# EasyEDA Pro project Loongson_Drivers.epro, schematic Schematic1

## Sheets
1 P1: Board Name: Board1; Create Date: 2025-04-17; Page Name: P1; Project Name: 龙芯驱动板; Schematic Name: Schematic1; Update Date: 2025-04-22; Company: 嘉立创EDA; Page Size: A4; Version: V1.0
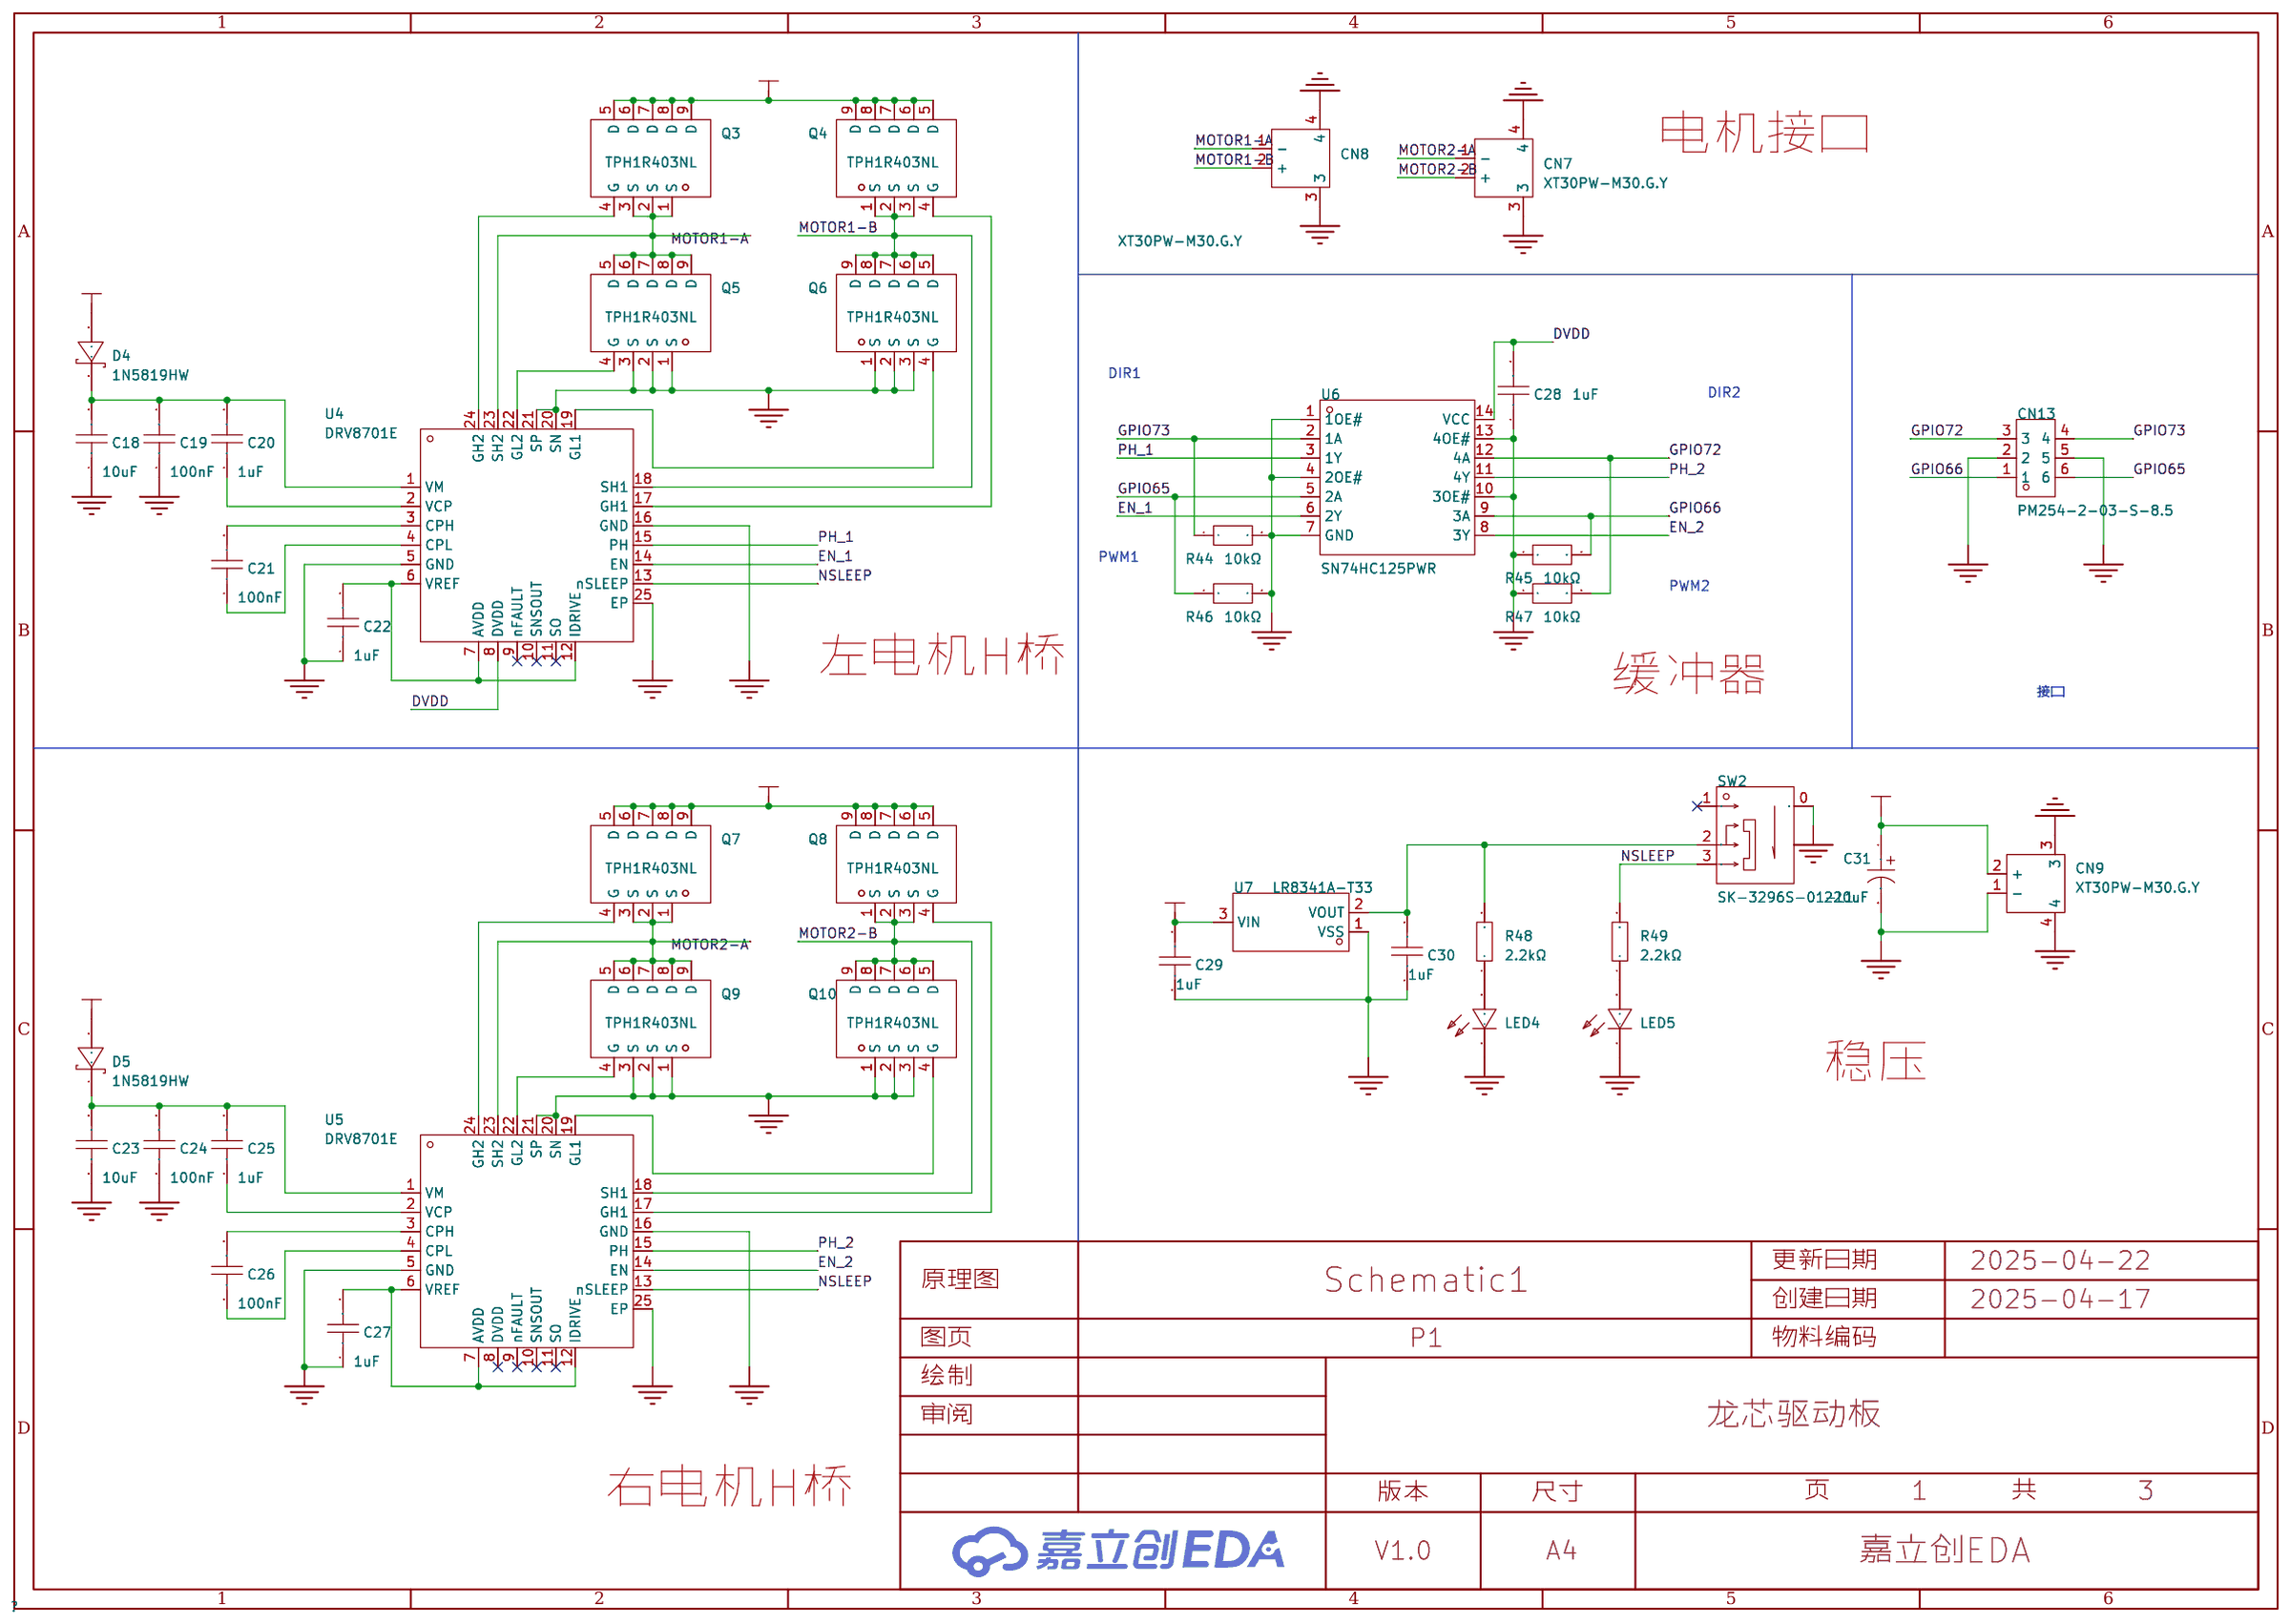
[diagram p0: P1]
2 P2: Create Date: 2025-04-18; Page Name: P2; Update Date: 2025-06-28
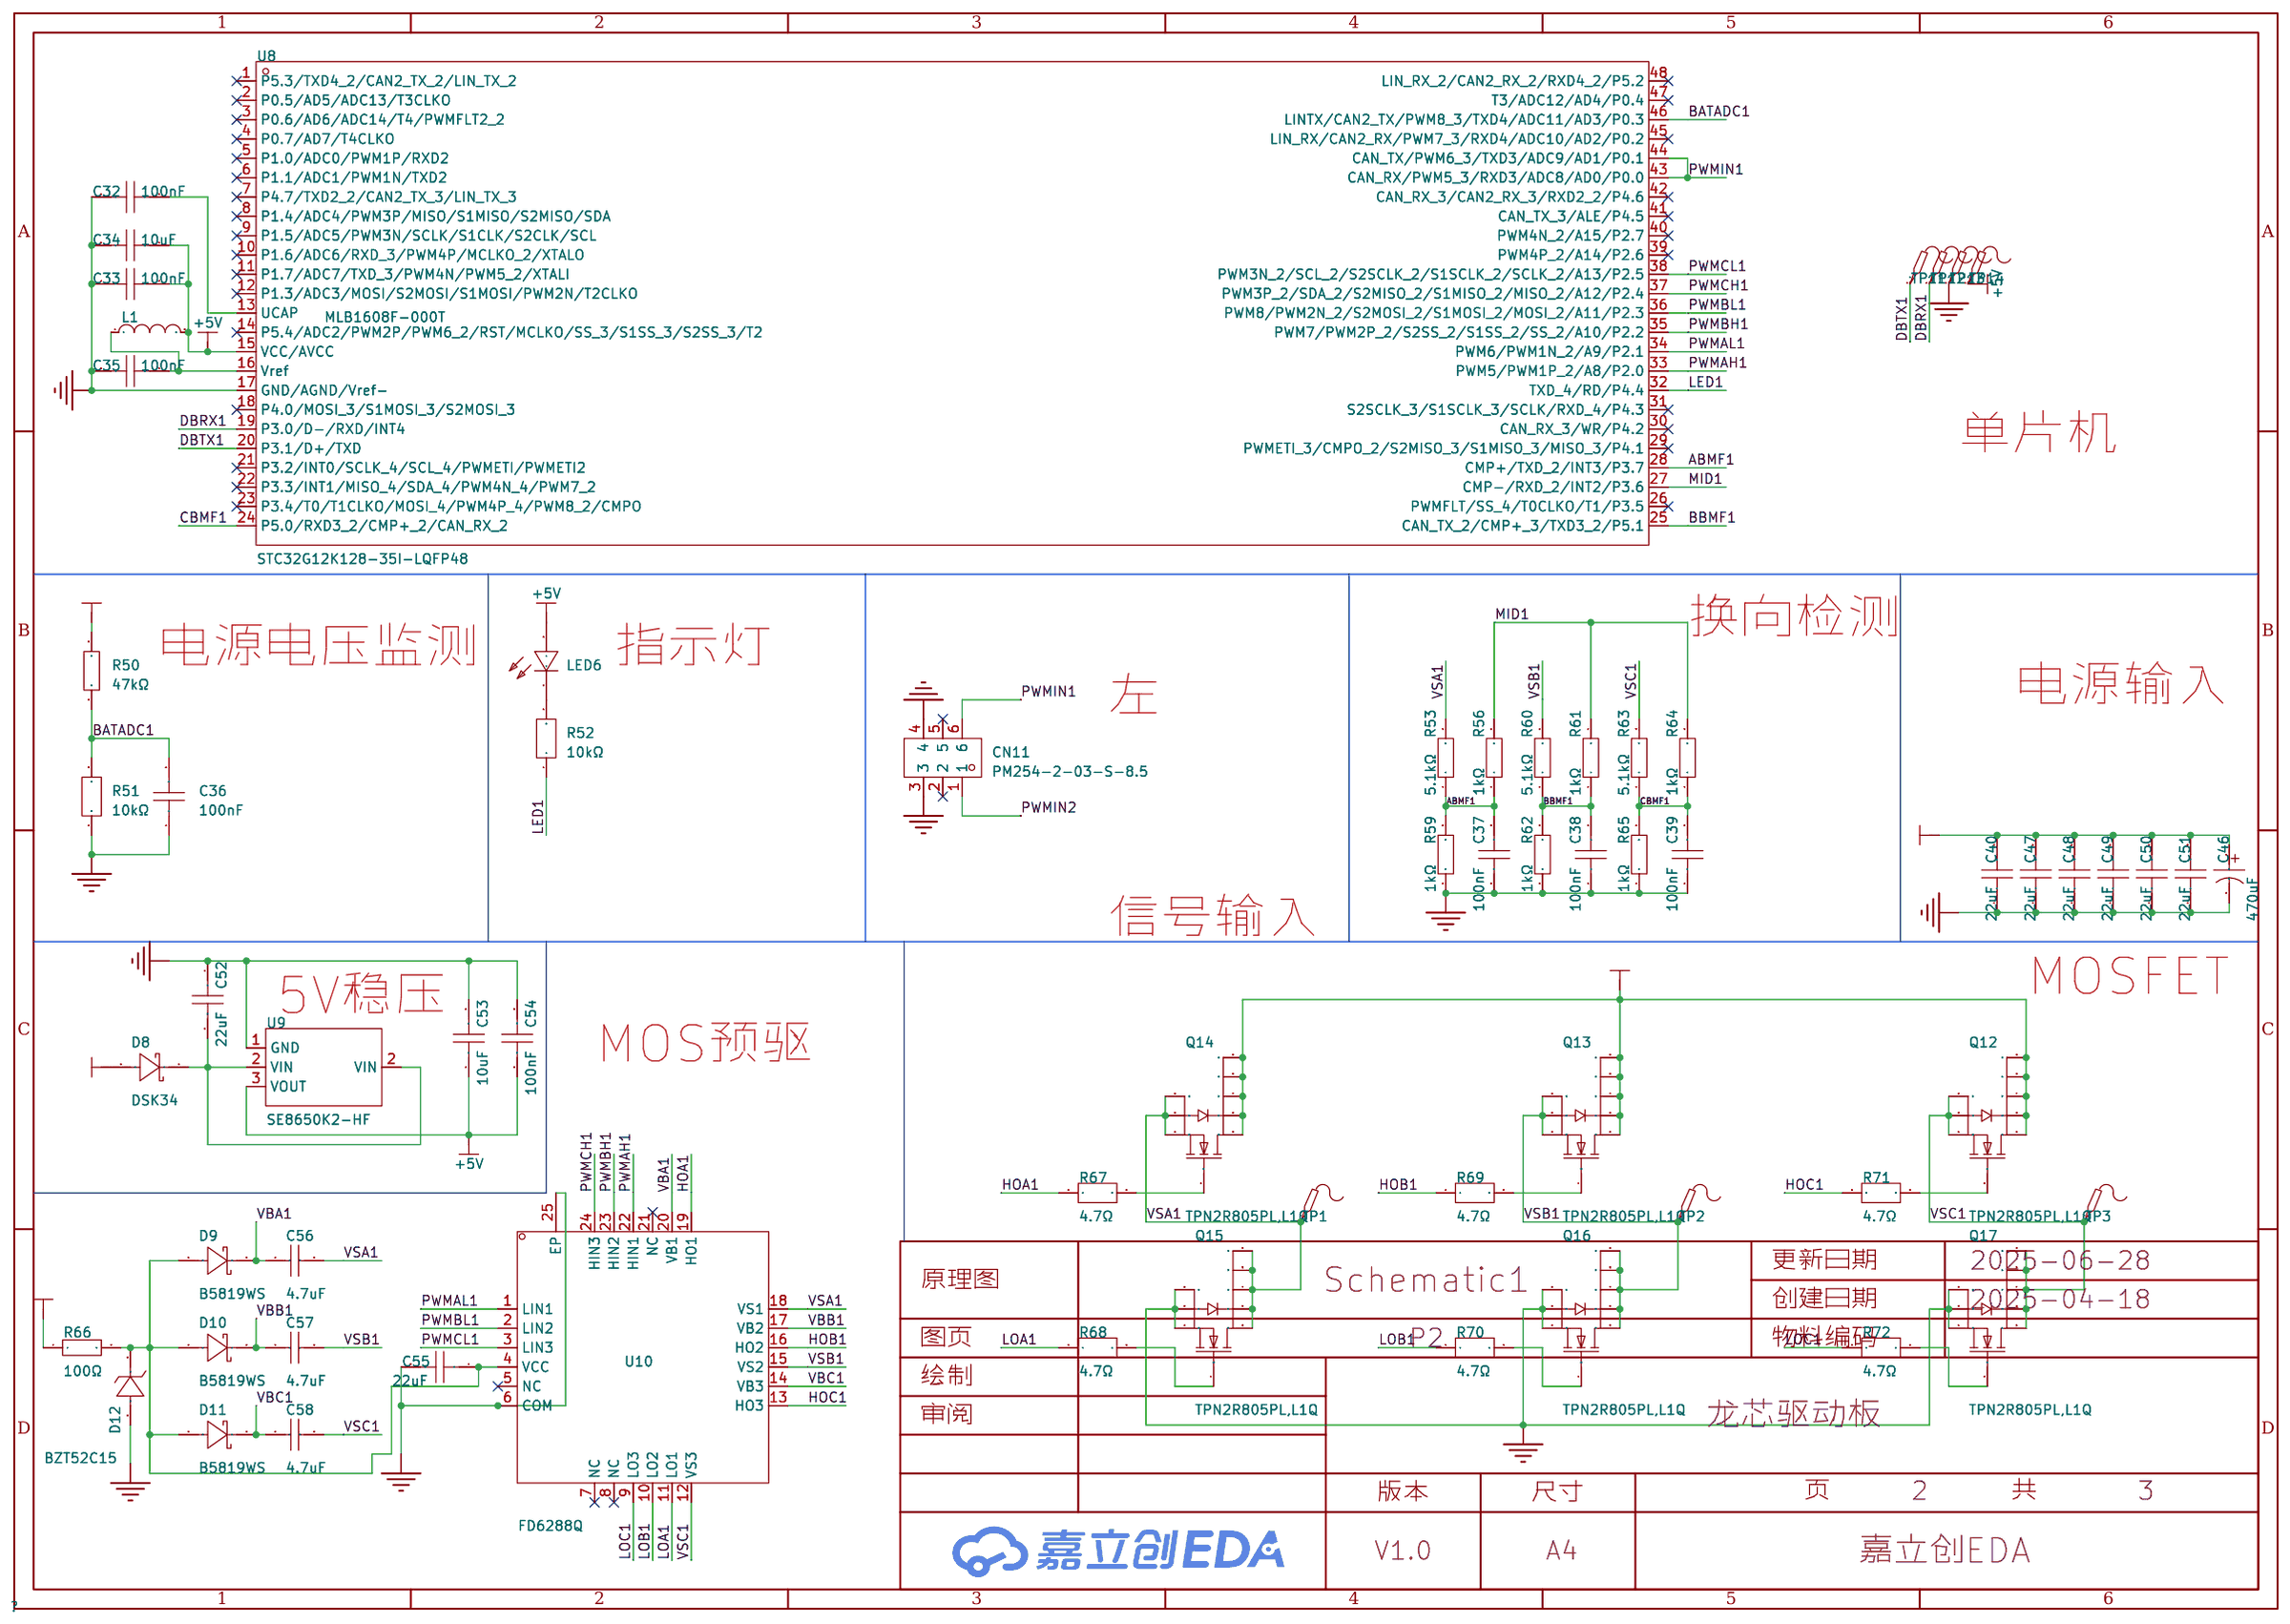
[diagram p1: P2]
3 P3: Create Date: 2025-04-18; Page Name: P3; Update Date: 2025-06-29
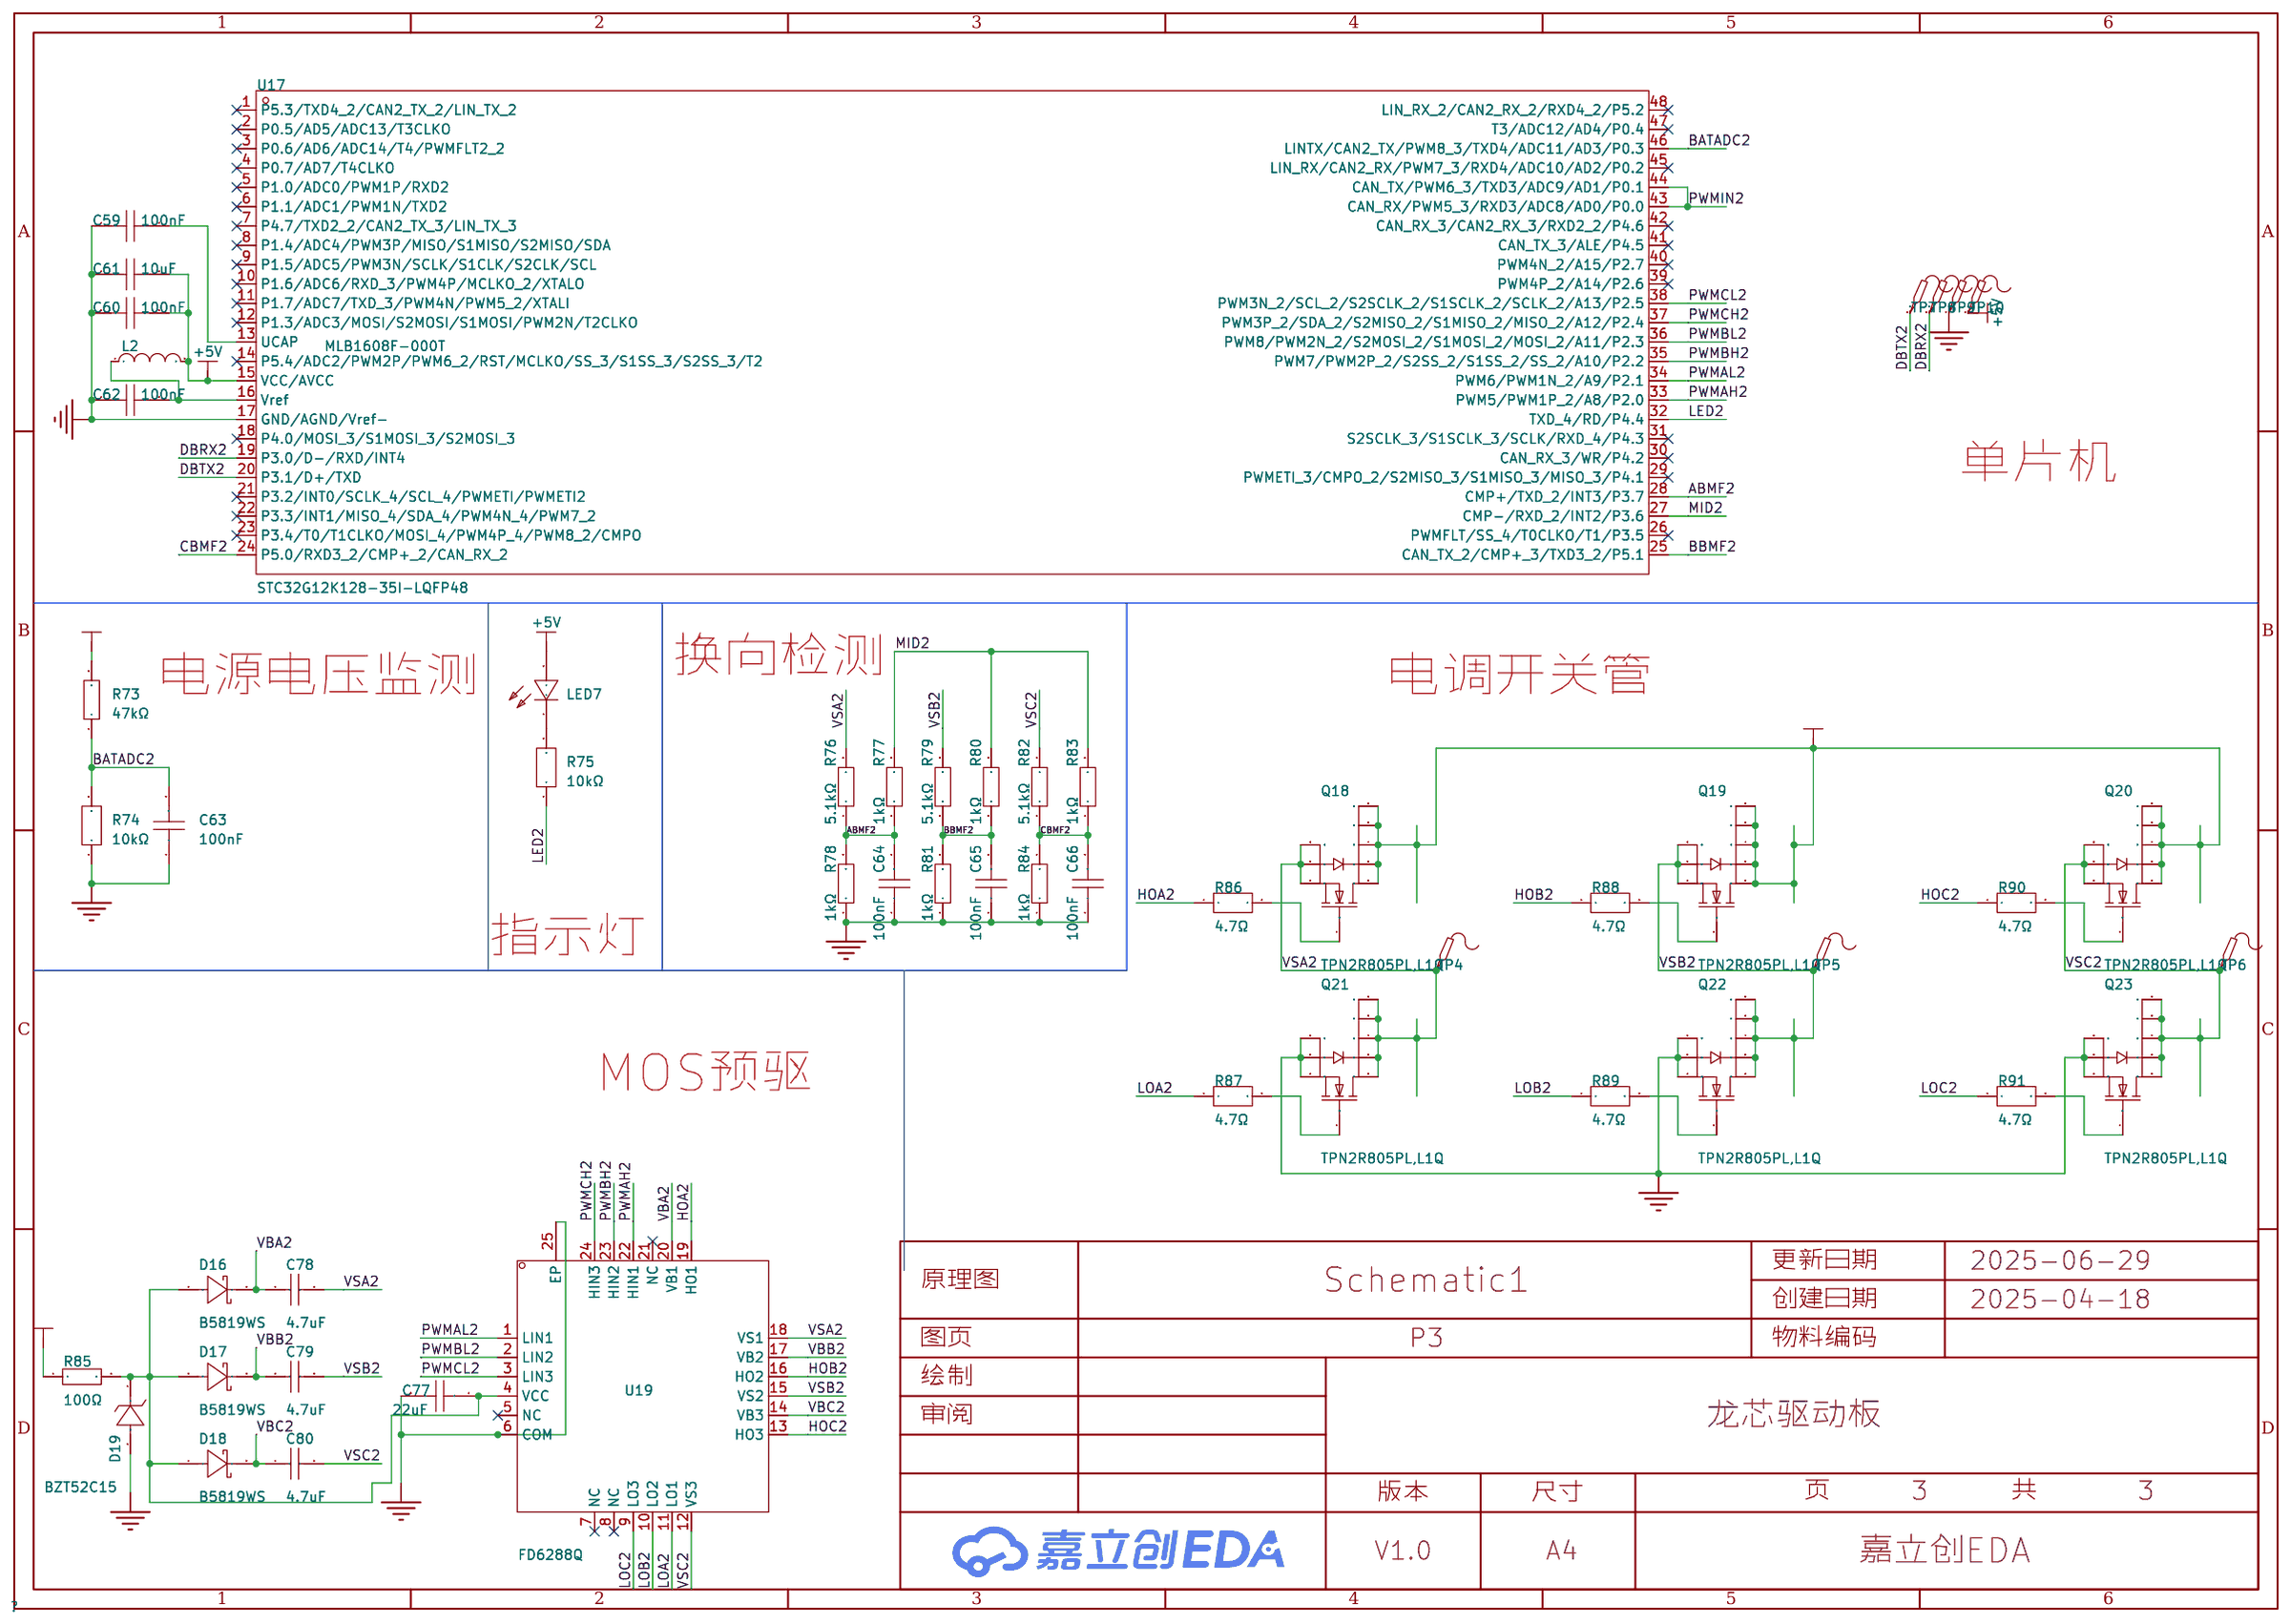
[diagram p2: P3]

## Parts
sheet P1
C18  10uF  [C0805]
C19  100nF  [C0603]
C20  1uF  [C0603]
C21  100nF  [C0603]
C22  1uF  [C0603]
C23  10uF  [C0805]
C24  100nF  [C0603]
C25  1uF  [C0603]
C26  100nF  [C0603]
C27  1uF  [C0603]
C28  1uF  [C0603]
C29  1uF  [C0603]
C30  1uF  [C0603]
C31  220uF  [CAP-SMD_BD8.0-L8.3-W8.3-LS9.1-FD]
CN7  XT30PW-M30.G.Y  [CONN-TH_XT30PW-M]
CN8  XT30PW-M30.G.Y  [CONN-TH_XT30PW-M]
CN9  XT30PW-M30.G.Y  [CONN-TH_XT30PW-M]
CN13  PM254-2-03-S-8.5  [HDR-SMD_6P-P2.54-V-F-R2-C3-LS7.0]
D4  1N5819HW  [SOD-123_L2.7-W1.6-LS3.7-RD]
D5  1N5819HW  [SOD-123_L2.7-W1.6-LS3.7-RD]
LED4  NCD0603R1  [LED0603-RD_RED]
LED5  NCD0603B1  [LED0603-RD]
Q3  TPH1R403NL  [DSOP-8_L5.0-W5.0-P1.27-LS6.0-BL-EP]
Q4  TPH1R403NL  [DSOP-8_L5.0-W5.0-P1.27-LS6.0-BL-EP]
Q5  TPH1R403NL  [DSOP-8_L5.0-W5.0-P1.27-LS6.0-BL-EP]
Q6  TPH1R403NL  [DSOP-8_L5.0-W5.0-P1.27-LS6.0-BL-EP]
Q7  TPH1R403NL  [DSOP-8_L5.0-W5.0-P1.27-LS6.0-BL-EP]
Q8  TPH1R403NL  [DSOP-8_L5.0-W5.0-P1.27-LS6.0-BL-EP]
Q9  TPH1R403NL  [DSOP-8_L5.0-W5.0-P1.27-LS6.0-BL-EP]
Q10  TPH1R403NL  [DSOP-8_L5.0-W5.0-P1.27-LS6.0-BL-EP]
R44  10kΩ  [R0603]
R45  10kΩ  [R0603]
R46  10kΩ  [R0603]
R47  10kΩ  [R0603]
R48  2.2kΩ  [R0603]
R49  2.2kΩ  [R0603]
SW2  SK-3296S-01-L1  [SW-SMD_3P-P1.50_L2.7-W6.6]
U4  DRV8701E  [VQFN-24_L4.0-W4.0-P0.50-BL-EP2.5]
U5  DRV8701E  [VQFN-24_L4.0-W4.0-P0.50-BL-EP2.5]
U6  SN74HC125PWR  [TSSOP-14_L5.0-W4.4-P0.65-LS6.5-BL]
U7  LR8341A-T33  [SOT-23-3L_L2.9-W1.6-P1.90-LS2.8-BL]
sheet P2
C32  100nF  [C0603]
C33  100nF  [C0603]
C34  10uF  [C0603]
C35  100nF  [C0603]
C36  100nF  [C0603]
C37  100nF  [C0603]
C38  100nF  [C0603]
C39  100nF  [C0603]
C40  22uF  [C0805]
C46  470uF  [CAP-SMD_BD10.0-L10.3-W10.3-LS11.0-R-RD]
C47  22uF  [C0805]
C48  22uF  [C0805]
C49  22uF  [C0805]
C50  22uF  [C0805]
C51  22uF  [C0805]
C52  22uF  [C0805]
C53  10uF  [C0603]
C54  100nF  [C0603]
C55  22uF  [C0805]
C56  4.7uF  [C0805]
C57  4.7uF  [C0805]
C58  4.7uF  [C0805]
CN11  PM254-2-03-S-8.5  [HDR-SMD_6P-P2.54-V-F-R2-C3-LS7.0]
D8  DSK34  [SOD-123FL_L2.7-W1.8-LS3.8-RD]
D9  B5819WS  [SOD-323_L1.7-W1.3-LS2.5-FD]
D10  B5819WS  [SOD-323_L1.7-W1.3-LS2.5-FD]
D11  B5819WS  [SOD-323_L1.7-W1.3-LS2.5-FD]
D12  BZT52C15  [SOD-123_L2.7-W1.6-LS3.7-RD]
L1  MLB1608F-000T  [L0603]
LED6  NCD0603R1  [LED0603-RD_RED]
Q12  TPN2R805PL,L1Q  [TSON-8_L3.1-W3.1-P0.65-LS3.3-BL-EP]
Q13  TPN2R805PL,L1Q  [TSON-8_L3.1-W3.1-P0.65-LS3.3-BL-EP]
Q14  TPN2R805PL,L1Q  [TSON-8_L3.1-W3.1-P0.65-LS3.3-BL-EP]
Q15  TPN2R805PL,L1Q  [TSON-8_L3.1-W3.1-P0.65-LS3.3-BL-EP]
Q16  TPN2R805PL,L1Q  [TSON-8_L3.1-W3.1-P0.65-LS3.3-BL-EP]
Q17  TPN2R805PL,L1Q  [TSON-8_L3.1-W3.1-P0.65-LS3.3-BL-EP]
R50  47kΩ  [R0603]
R51  10kΩ  [R0603]
R52  10kΩ  [R0603]
R53  5.1kΩ  [R0603]
R56  1kΩ  [R0603]
R59  1kΩ  [R0603]
R60  5.1kΩ  [R0603]
R61  1kΩ  [R0603]
R62  1kΩ  [R0603]
R63  5.1kΩ  [R0603]
R64  1kΩ  [R0603]
R65  1kΩ  [R0603]
R66  100Ω  [R0603]
R67  4.7Ω  [R0603]
R68  4.7Ω  [R0603]
R69  4.7Ω  [R0603]
R70  4.7Ω  [R0603]
R71  4.7Ω  [R0603]
R72  4.7Ω  [R0603]
TP1  -  [Test-Point-0.5mm]
TP2  -  [Test-Point-0.5mm]
TP3  -  [Test-Point-0.5mm]
TP11  -  [Test-Point-0.5mm]
TP12  -  [Test-Point-0.5mm]
TP13  -  [Test-Point-0.5mm]
TP14  -  [Test-Point-0.5mm]
U8  STC32G12K128-35I-LQFP48  [LQFP-48_L7.0-W7.0-P0.50-LS9.0-BL]
U9  SE8650K2-HF  [SOT-89-3_L4.5-W2.5-P1.50-LS4.2-BR]
U10  FD6288Q  [QFN-24_L4.0-W4.0-P0.50-BL-EP2.6]
sheet P3
C59  100nF  [C0603]
C60  100nF  [C0603]
C61  10uF  [C0603]
C62  100nF  [C0603]
C63  100nF  [C0603]
C64  100nF  [C0603]
C65  100nF  [C0603]
C66  100nF  [C0603]
C77  22uF  [C0805]
C78  4.7uF  [C0805]
C79  4.7uF  [C0805]
C80  4.7uF  [C0805]
D16  B5819WS  [SOD-323_L1.7-W1.3-LS2.5-FD]
D17  B5819WS  [SOD-323_L1.7-W1.3-LS2.5-FD]
D18  B5819WS  [SOD-323_L1.7-W1.3-LS2.5-FD]
D19  BZT52C15  [SOD-123_L2.7-W1.6-LS3.7-RD]
L2  MLB1608F-000T  [L0603]
LED7  NCD0603R1  [LED0603-RD_RED]
Q18  TPN2R805PL,L1Q  [TSON-8_L3.1-W3.1-P0.65-LS3.3-BL-EP]
Q19  TPN2R805PL,L1Q  [TSON-8_L3.1-W3.1-P0.65-LS3.3-BL-EP]
Q20  TPN2R805PL,L1Q  [TSON-8_L3.1-W3.1-P0.65-LS3.3-BL-EP]
Q21  TPN2R805PL,L1Q  [TSON-8_L3.1-W3.1-P0.65-LS3.3-BL-EP]
Q22  TPN2R805PL,L1Q  [TSON-8_L3.1-W3.1-P0.65-LS3.3-BL-EP]
Q23  TPN2R805PL,L1Q  [TSON-8_L3.1-W3.1-P0.65-LS3.3-BL-EP]
R73  47kΩ  [R0603]
R74  10kΩ  [R0603]
R75  10kΩ  [R0603]
R76  5.1kΩ  [R0603]
R77  1kΩ  [R0603]
R78  1kΩ  [R0603]
R79  5.1kΩ  [R0603]
R80  1kΩ  [R0603]
R81  1kΩ  [R0603]
R82  5.1kΩ  [R0603]
R83  1kΩ  [R0603]
R84  1kΩ  [R0603]
R85  100Ω  [R0603]
R86  4.7Ω  [R0603]
R87  4.7Ω  [R0603]
R88  4.7Ω  [R0603]
R89  4.7Ω  [R0603]
R90  4.7Ω  [R0603]
R91  4.7Ω  [R0603]
TP4  -  [Test-Point-0.5mm]
TP5  -  [Test-Point-0.5mm]
TP6  -  [Test-Point-0.5mm]
TP7  -  [Test-Point-0.5mm]
TP8  -  [Test-Point-0.5mm]
TP9  -  [Test-Point-0.5mm]
TP10  -  [Test-Point-0.5mm]
U17  STC32G12K128-35I-LQFP48  [LQFP-48_L7.0-W7.0-P0.50-LS9.0-BL]
U19  FD6288Q  [QFN-24_L4.0-W4.0-P0.50-BL-EP2.6]

## Library data of the parts
C18 C23 = CGA0805X5R106K350MT: 容值:10uF;精度:±10%;额定电压:35V;材质(温度系数):X5R;; LCSC Part Name: 10uF ±10% 35V; Supplier Part: C6119888; Manufacturer: HRE(芯声); Supplier Footprint: 0805; JLCPCB Part Class: 扩展库; Supplier: LCSC; Tolerance: ±10%; Voltage Rated: 35V; Temperature Coefficient: X5R
C19 C21 C24 C26 = GMK107B7104KAHT: 容值:100nF;精度:±10%;额定电压:35V;材质(温度系数):X7R;; LCSC Part Name: 100nF ±10% 35V; Supplier Part: C385964; Manufacturer: TAIYO YUDEN(太诱); Supplier Footprint: 0603; JLCPCB Part Class: 扩展库; Datasheet: https://atta.szlcsc.com/upload/public/pdf/source/20220225/799C51BCBF8C89A221BF0BDF23636E5D.pdf; Supplier: LCSC; Tolerance: ±10%; Voltage Rated: 35V; Temperature Coefficient: X7R
C20 C22 C25 C27-C30 = CL10A105KB8NNNC: 容值:1uF;精度:±10%;额定电压:50V;材质(温度系数):X5R;; LCSC Part Name: 1uF ±10% 50V; Supplier Part: C15849; Manufacturer: SAMSUNG(三星); Supplier Footprint: 0603; JLCPCB Part Class: 基础库; Datasheet: https://atta.szlcsc.com/upload/public/pdf/source/20160218/1457707763339.pdf; Supplier: LCSC; Tolerance: ±10%; Voltage Rated: 50V; Temperature Coefficient: X5R
C31 = HV1V227M0810PZ: 容值:220uF;精度:±20%;额定电压:35V;; LCSC Part Name: 220uF ±20% 35V; Supplier Part: C5246556; Manufacturer: HONOR(荣誉); Supplier Footprint: SMD,D8xL10.5mm; JLCPCB Part Class: 扩展库; Datasheet: https://atta.szlcsc.com/upload/public/pdf/source/20240802/61683F5000C7CFED5606ABBE3CFBE0F5.pdf; Supplier: LCSC; Tolerance: ±20%; Rated Voltage: 35V; φD: 8mm; L: 10mm; Operating Temperature: -55℃~+105℃
CN7-CN9 = XT30PW-M30.G.Y: 类别:-;类型1:-;; LCSC Part Name: AMASS(艾迈斯)航模插头 卧式弯脚 XT30PW-M公头; Supplier Part: C431092; Manufacturer: AMASS(艾迈斯); JLCPCB Part Class: 扩展库; Datasheet: https://atta.szlcsc.com/upload/public/pdf/source/20220222/6A9F22F7850E25B33E1BE430ADF8560B.pdf; Supplier: LCSC; Type: 航模插头; RatedVoltage: DC 500V; InterfaceType: 公头; RatedCurrent: 15A; RecommendedWireGauge: 16/18/20AWG; contact resistance: 1.2mΩ; specifications: 2pin
CN11 CN13 = PM254-2-03-S-8.5: 插孔结构:2x3P;间距:2.54mm;行距:2.54mm;圆孔/方孔:方孔;安装方式:立贴;排数:双排;总孔位数:6P;额定电流:3A;插孔方向:顶部;塑高:8.5mm;触头材质:铜合金;工作温度:-40℃~+105℃;; LCSC Part Name: 2x3P 间距:2.54mm 立贴; Supplier Part: C3975148; Manufacturer: HCTL(华灿天禄); Supplier Footprint: SMD,P=2.54mm; JLCPCB Part Class: 扩展库; Datasheet: https://atta.szlcsc.com/upload/public/pdf/source/20230609/7C6F8D8E301C6BBC8F19D55951C36597.pdf; Supplier: LCSC; Holes Structure: 2x3P; Pitch: 2.54mm; Row Spacing: 2.54mm; Circular Hole / Square Hole: 方孔; Mounting Type: 立贴; Number of Rows: 双排; Number of Positions: 6P; Current Rating: 3A; Holes Direction: 顶部; Insulation Height: 8.5mm; Contact Material: 铜合金; Operating Temperature: -40℃~+105℃
D4 D5 = 1N5819HW-7-F: 正向压降(Vf):450mV@1A;直流反向耐压(Vr):40V;整流电流:1A;; LCSC Part Name: 电压:40V 电流:1A; Supplier Part: C82544; Manufacturer: DIODES(美台); Supplier Footprint: SOD-123; JLCPCB Part Class: 扩展库; Datasheet: https://atta.szlcsc.com/upload/public/pdf/source/20161024/1477288459223.pdf; Supplier: LCSC; Forward Voltage (Vf@If): 450mV@1A; Reverse Voltage (Vr): 40V; Rectified Current: 1A; Reverse Leakage Current (Ir): 1mA@40V
LED4 LED6 LED7 = NCD0603R1_C84263: 灯头类型:-;发光颜色:红色;正向电压(VF):1.6V~2.6V;功率:65mW;正向电流:20mA;主波长:615nm~630nm;二极管配置:独立二极管;透镜颜色:无色透明透镜;色温:-;发光强度:80mcd~220mcd;发光角度:130°;载带方式:-;工作温度:-30℃~+85℃;; Supplier Part: C84263; Manufacturer: 国星光电; Supplier Footprint: 0603; JLCPCB Part Class: 扩展库; Datasheet: https://atta.szlcsc.com/upload/public/pdf/source/20200820/C84263_DABC6A75E58F576973B407FDBA283D60.pdf; Supplier: LCSC; Emitted Color: 红色; Forward Voltage (VF): 1.6V~2.6V; Power Dissipation: 65mW; Forward Current: 20mA; Dominant Wavelength: 615nm~630nm; Diode Configuration: 独立二极管; Lens Color: 无色透明透镜; Luminous Intensity: 80mcd~220mcd; Viewing Angle: 130°; Operating Temperature: -30℃~+85℃
LED5 = NCD0603B1: 发光颜色:蓝色;正向电压(VF):2.6V~3.6V;功率:72mW;正向电流:10mA;主波长:463nm~475nm;透镜颜色:无色透明透镜;发光强度:80mcd~220mcd;发光角度:130°;工作温度:-30℃~+85℃;; Supplier Part: C84266; Manufacturer: 国星光电; Supplier Footprint: 0603; JLCPCB Part Class: 扩展库; Datasheet: https://atta.szlcsc.com/upload/public/pdf/source/20200820/C84266_6A3CDBEFA72C6CAD68EDA53474ADAE6C.pdf; Supplier: LCSC; Emitted Color: 蓝色; Forward Voltage (VF): 2.6V~3.6V; Power Dissipation: 72mW; Forward Current: 10mA; Dominant Wavelength: 463nm~475nm; Lens Color: 无色透明透镜; Luminous Intensity: 80mcd~220mcd; Viewing Angle: 130°; Operating Temperature: -30℃~+85℃
Q3-Q10 = TPH1R403NL_C83440: 类型:1个N沟道;漏源电压(Vdss):30V;连续漏极电流(Id):150A;导通电阻(RDS(on)@Vgs,Id):1.7mΩ@4.5V,30A;功率:64W;阈值电压(Vgs(th)@Id):1.3V@0.5mA;; LCSC Part Name: 1个N沟道 耐压:30V 电流:150A; Supplier Part: C83440; Manufacturer: TOSHIBA(东芝); Supplier Footprint: DFN-8(5x6); JLCPCB Part Class: 扩展库; Datasheet: https://atta.szlcsc.com/upload/public/pdf/source/20170908/C83440_1504870121708958077.pdf; Supplier: LCSC; Type: 1个N沟道; Drain Source Voltage (Vdss): 30V; Continuous Drain Current (Id): 150A; Drain Source On Resistance (RDS(on)@Vgs,Id): 1.7mΩ@4.5V,30A; Power Dissipation (Pd): 64W; Gate Threshold Voltage (Vgs(th)@Id): 1.3V@0.5mA; Total Gate Charge (Qg@Vgs): 46nC@15V; Input Capacitance (Ciss@Vds): 3.4nF@15V; Reverse Transfer Capacitance (Crss@Vds): 200pF@15V; Operating Temperature: -55℃~+150℃
R44-R47 R51 R52 R74 R75 = FRC0603J103TS: 电阻类型:厚膜电阻;阻值:10kΩ;精度:±5%;功率:100mW;最大工作电压:75V;温度系数:±100ppm/℃;; LCSC Part Name: 10kΩ ±5% 100mW 厚膜电阻; Supplier Part: C2930027; Manufacturer: FOJAN(富捷); Supplier Footprint: 0603; JLCPCB Part Class: 扩展库; Datasheet: https://atta.szlcsc.com/upload/public/pdf/source/20211221/925EC7D7225764EE0046F22065062C87.pdf; Supplier: LCSC; Type: 厚膜电阻; Tolerance: ±5%; Power(Watts): 100mW; Overload Voltage (Max): 75V; Temperature Coefficient: ±100ppm/℃; Operating Temperature Range: -55℃~+155℃
R48 R49 = 0603WAF2201T5E: 电阻类型:厚膜电阻;阻值:2.2kΩ;精度:±1%;功率:100mW;最大工作电压:75V;温度系数:±100ppm/℃;; LCSC Part Name: 2.2kΩ ±1% 100mW 厚膜电阻; Supplier Part: C4190; Manufacturer: UNI-ROYAL(厚声); Supplier Footprint: 0603; JLCPCB Part Class: 基础库; Datasheet: https://atta.szlcsc.com/upload/public/pdf/source/20200306/C422600_1E6D84923E4A46A82E41ADD87F860B5C.pdf; Supplier: LCSC; Type: 厚膜电阻; Tolerance: ±1%; Power(Watts): 100mW; Overload Voltage (Max): 75V; Temperature Coefficient: ±100ppm/℃; Operating Temperature Range: -55℃~+155℃
SW2 = SK-3296S-01-L1: 电路结构:单刀双掷;安装方式:卧贴;开关颜色:黑色;额定电流(DC):50mA;额定电压(DC):12V;额定电流(AC):50mA;额定电压(AC):12V;机械寿命:1万次;; LCSC Part Name: 柄长1.5mm 卧贴双档 滑动开关; Supplier Part: C319020; Manufacturer: XKB Connectivity(中国星坤); Supplier Footprint: SMD; JLCPCB Part Class: 扩展库; Datasheet: https://atta.szlcsc.com/upload/public/pdf/source/20211011/33977E7F5E3AE40A3E3DC6795807E20F.pdf; Supplier: LCSC; Circuit: 单刀双掷; Actuator Style: 矩形柱状; Pin Style: SMD接片; Switch Length: 7.8mm; Switch Width: 2.75mm; Switch Height: 1.35mm; Mounting Style: 卧贴; Actuator Color: 黑色; Current Rating (DC): 50mA; Voltage Rating (DC): 12V; Current Rating (AC): 50mA; Voltage Rating (AC): 12V; Mechanical Life: 1万次; Operating Temperature: -40℃~+85℃
U4 U5 = DRV8701ERGET: DRV8701 47V H 桥智能栅极驱动器; LCSC Part Name: 有刷直流电机驱动芯片 5.5V; Supplier Part: C132049; Manufacturer: TI(德州仪器); Supplier Footprint: VQFN-24(4x4); JLCPCB Part Class: 扩展库; Datasheet: https://www.ti.com/cn/lit/gpn/drv8701; Supplier: LCSC
U6 = SN74HC125PWR: 输入类型:-;电源电压:2V~6V;元件数:4;每个元件位数:1;灌电流(IOL):7.8mA;拉电流(IOH):7.8mA;; Supplier Part: C132994; Manufacturer: TI(德州仪器); Supplier Footprint: TSSOP-14; JLCPCB Part Class: 扩展库; Datasheet: https://www.ti.com/cn/lit/gpn/sn74hc125; Supplier: LCSC; output type: 三态; Supply Voltage: 2V~6V; Number of Elements: 4; Number of Bits per Element: 1; Sink Current: 7.8mA; Source Current: 7.8mA; Logic Family: 74HC; Operating Temperature: -40℃~+85℃
U7 = LR8341A-T33: 输出类型:固定;最大输入电压:40V;输出电压:3.3V;最大输出电流:100mA;电源纹波抑制比(PSRR):55dB@(1kHz);输出极性:正极;; LCSC Part Name: 输入40V 输出3.3V 100mA; Supplier Part: C2829465; Manufacturer: LR(朗瑞); Supplier Footprint: SOT-23-3L; JLCPCB Part Class: 扩展库; Datasheet: https://atta.szlcsc.com/upload/public/pdf/source/20210426/C2829465_61F15D7ACE9671B48D4F69A8092B0D8F.pdf; Supplier: LCSC; Output Type: 固定; Maximum Input Voltage: 40V; Output Voltage: 3.3V; MAX Output Current: 100mA; Power Supply Rejection Ratio (PSRR): 55dB@(1kHz); standby current: 2uA; Operating Temperature: -40℃~+85℃; Output Polarity: 正极; Number of Outputs: 1
C32 C33 C35-C39 C54 C59 C60 C62-C66 = CGA0603X7R104K500JT: 容值:100nF;精度:±10%;额定电压:50V;材质(温度系数):X7R;; LCSC Part Name: 100nF ±10% 50V; Supplier Part: C6119867; Manufacturer: HRE(芯声); Supplier Footprint: 0603; JLCPCB Part Class: 扩展库; Supplier: LCSC; Tolerance: ±10%; Voltage Rated: 50V; Temperature Coefficient: X7R
C34 C53 C61 = CGA0603X5R106K100JT: 容值:10uF;精度:±10%;额定电压:10V;温度系数:X5R;; LCSC Part Name: 10uF ±10% 10V; Supplier Part: C6119842; Manufacturer: HRE(芯声); Supplier Footprint: 0603; JLCPCB Part Class: 扩展库; Supplier: LCSC; Tolerance: ±10%; Voltage Rating: 10V; Temperature Coefficient: X5R
C40 C47-C52 C55 C77 = CGA0805X5R226M250MT: 容值:22uF;精度:±20%;额定电压:25V;温度系数:X5R;; LCSC Part Name: 22uF ±20% 25V; Supplier Part: C6119899; Manufacturer: HRE(芯声); Supplier Footprint: 0805; JLCPCB Part Class: 扩展库; Supplier: LCSC; Tolerance: ±20%; Voltage Rating: 25V; Temperature Coefficient: X5R
C46 = RVT1V471M1010_C72519: 容值:470uF;精度:±20%;额定电压:35V;纹波电流:286mA@120Hz;等效串联电阻(ESR):-;; LCSC Part Name: 470uF ±20% 35V; Supplier Part: C72519; Manufacturer: ROQANG(容强); Manufacturer Part: RVT1V471M1010; Supplier Footprint: SMD,D10xL10.2mm; JLCPCB Part Class: Extended Part; Datasheet: https://atta.szlcsc.com/upload/public/pdf/source/20210128/C72519_A1B8ED607B11AD36B70B1D23AFC8819E.pdf; Supplier: LCSC; Tolerance: ±20%; Voltage Rating: 35V; Ripple Current: 286mA@120Hz; Diameter: 10mm; Height - Seated (Max): 10.2mm; Lifetime: 2000hrs@105℃; Operating Temperature: -40℃~+105℃
C56-C58 C78-C80 = CL21A475KAQNNNE: 容值:4.7uF;精度:±10%;额定电压:25V;材质(温度系数):X5R;; LCSC Part Name: 4.7uF ±10% 25V; Supplier Part: C1779; Manufacturer: SAMSUNG(三星); Supplier Footprint: 0805; JLCPCB Part Class: 基础库; Datasheet: https://atta.szlcsc.com/upload/public/pdf/source/20160218/1457707763339.pdf; Supplier: LCSC; Tolerance: ±10%; Voltage Rated: 25V; Temperature Coefficient: X5R
D8 = DSK34_C7502709: 二极管配置:独立式;正向压降(Vf):550mV@3A;直流反向耐压(Vr):40V;整流电流:3A;; LCSC Part Name: 电压:40V 电流:3A; Supplier Part: C7502709; Manufacturer: 宏迦橙; Supplier Footprint: SOD-123FL; JLCPCB Part Class: Extended Part; Datasheet: https://atta.szlcsc.com/upload/public/pdf/source/20240814/5E8D2EAF2EE69BEF369BE6AC64F67CC4.pdf; Supplier: LCSC; Diode Configuration: 独立式; Forward Voltage (Vf@If): 550mV@3A; Reverse Voltage (Vr): 40V; Rectified Current: 3A; Reverse Leakage Current (Ir): 500uA
D9-D11 D16-D18 = B5819WS_C7420331: 二极管配置:独立式;正向压降(Vf):600mV@1.0A;直流反向耐压(Vr):40V;整流电流:1A;; LCSC Part Name: 电压:40V 电流:1A; Supplier Part: C7420331; Manufacturer: 宏迦橙; Supplier Footprint: SOD-323; JLCPCB Part Class: 扩展库; Datasheet: https://atta.szlcsc.com/upload/public/pdf/source/20230828/03CA0F4F90DAE368A7153B7B5E4D0651.pdf; Supplier: LCSC; Diode Configuration: 独立式; Forward Voltage (Vf@If): 600mV@1.0A; Reverse Voltage (Vr): 40V; Rectified Current: 1A; Reverse Leakage Current (Ir): 1mA@40V
D12 D19 = BZT52C15_C19077412: 二极管配置:独立式;稳压值(标称值):15V;稳压值(范围):14.25V~15.75V;耗散功率(Pd):500mW;; Supplier Part: C19077412; Manufacturer: 宏嘉诚; Supplier Footprint: SOD-123; JLCPCB Part Class: 扩展库; Datasheet: https://atta.szlcsc.com/upload/public/pdf/source/20250106/E12AA82D484C9C66E469D005F460C1F7.pdf; Supplier: LCSC; Diode Configuration: 独立式; Zener Voltage(Nom): 15V; Reverse Leakage Current (Ir): 100nA@10.5V; Zener Voltage(Range): 14.25V~15.75V; Pd - Power Dissipation(Pd): 500mW; Impedance(Zzt): 40Ω
L1 L2 = MLB1608F-000T: 阻抗@频率:0Ω@100MHz;误差:±25%;直流电阻(DCR):-;; LCSC Part Name: 单路 0603磁珠 阻抗0Ω@100MHz; Supplier Part: C2844549; Manufacturer: MetalLions(美铼); Supplier Footprint: 0603; JLCPCB Part Class: 扩展库; Datasheet: https://atta.szlcsc.com/upload/public/pdf/source/20230602/7F9B6FFD64AF4C161BE293D8440B9AF6.pdf; Supplier: LCSC; Impedance @ Frequency: 0Ω@100MHz; Tolerance: ±25%; Number of Circuits: 1
Q12-Q23 = TPN2R805PL,L1Q: 类型:1个N沟道;漏源电压(Vdss):45V;连续漏极电流(Id):139A；80A;功率(Pd):2.67W；104W;导通电阻(RDS(on)@Vgs,Id):2.8mΩ@40A,10V;阈值电压(Vgs(th)@Id):2.4V@300uA;; LCSC Part Name: 1个N沟道 耐压:45V 电流:80A 电流:139A; Supplier Part: C6290312; Manufacturer: TOSHIBA(东芝); Supplier Footprint: TSON-8(3.1x3.1); JLCPCB Part Class: 扩展库; Supplier: LCSC; Type: 1个N沟道; Drain Source Voltage (Vdss): 45V; Continuous Drain Current (Id): 139A；80A; Power Dissipation (Pd): 2.67W；104W; Drain Source On Resistance (RDS(on)@Vgs,Id): 2.8mΩ@40A,10V; Gate Threshold Voltage (Vgs(th)@Id): 2.4V@300uA; Total Gate Charge (Qg@Vgs): 39nC@10V; Input Capacitance (Ciss@Vds): 3.2nF@22.5V
R50 R73 = 0603WAF4702T5E: 电阻类型:厚膜电阻;阻值:47kΩ;精度:±1%;功率:100mW;最大工作电压:75V;温度系数:±100ppm/℃;; LCSC Part Name: 47kΩ ±1% 100mW 厚膜电阻; Supplier Part: C25819; Manufacturer: UNI-ROYAL(厚声); Supplier Footprint: 0603; JLCPCB Part Class: 基础库; Datasheet: https://atta.szlcsc.com/upload/public/pdf/source/20200306/C422600_1E6D84923E4A46A82E41ADD87F860B5C.pdf; Supplier: LCSC; Type: 厚膜电阻; Tolerance: ±1%; Power(Watts): 100mW; Overload Voltage (Max): 75V; Temperature Coefficient: ±100ppm/℃; Operating Temperature Range: -55℃~+155℃
R53 R60 R63 R76 R79 R82 = 0603WAF5101T5E: 电阻类型:厚膜电阻;阻值:5.1kΩ;精度:±1%;功率:100mW;最大工作电压:75V;温度系数:±100ppm/℃;; LCSC Part Name: 5.1kΩ ±1% 100mW 厚膜电阻; Supplier Part: C23186; Manufacturer: UNI-ROYAL(厚声); Supplier Footprint: 0603; JLCPCB Part Class: 基础库; Datasheet: https://atta.szlcsc.com/upload/public/pdf/source/20200306/C422600_1E6D84923E4A46A82E41ADD87F860B5C.pdf; Supplier: LCSC; Type: 厚膜电阻; Tolerance: ±1%; Power(Watts): 100mW; Overload Voltage (Max): 75V; Temperature Coefficient: ±100ppm/℃; Operating Temperature Range: -55℃~+155℃
R56 R59 R61 R62 R64 R65 R77 R78 R80 R81 R83 R84 = 0603WAF1001T5E: 电阻类型:厚膜电阻;阻值:1kΩ;精度:±1%;功率:100mW;最大工作电压:75V;温度系数:±100ppm/℃;; LCSC Part Name: 1kΩ ±1% 100mW 厚膜电阻; Supplier Part: C21190; Manufacturer: UNI-ROYAL(厚声); Supplier Footprint: 0603; JLCPCB Part Class: 基础库; Datasheet: https://atta.szlcsc.com/upload/public/pdf/source/20200306/C422600_1E6D84923E4A46A82E41ADD87F860B5C.pdf; Supplier: LCSC; Type: 厚膜电阻; Tolerance: ±1%; Power(Watts): 100mW; Overload Voltage (Max): 75V; Temperature Coefficient: ±100ppm/℃; Operating Temperature Range: -55℃~+155℃
R66 R85 = 0603WAF1000T5E: 电阻类型:厚膜电阻;阻值:100Ω;精度:±1%;功率:100mW;最大工作电压:75V;温度系数:±200ppm/℃;; LCSC Part Name: 100Ω ±1% 100mW 厚膜电阻; Supplier Part: C22775; Manufacturer: UNI-ROYAL(厚声); Supplier Footprint: 0603; JLCPCB Part Class: 基础库; Datasheet: https://atta.szlcsc.com/upload/public/pdf/source/20200306/C422600_1E6D84923E4A46A82E41ADD87F860B5C.pdf; Supplier: LCSC; Type: 厚膜电阻; Tolerance: ±1%; Power(Watts): 100mW; Overload Voltage (Max): 75V; Temperature Coefficient: ±200ppm/℃; Operating Temperature Range: -55℃~+155℃
R67-R72 R86-R91 = FRC0603J4R7 TS: 电阻类型:厚膜电阻;阻值:4.7Ω;精度:±5%;功率:100mW;工作电压:75V;温度系数:±200ppm/℃;; LCSC Part Name: 4.7Ω ±5% 100mW 厚膜电阻; Supplier Part: C2907168; Manufacturer: FOJAN(富捷); Supplier Footprint: 0603; JLCPCB Part Class: 扩展库; Datasheet: https://atta.szlcsc.com/upload/public/pdf/source/20211221/925EC7D7225764EE0046F22065062C87.pdf; Supplier: LCSC; Type: 厚膜电阻; Tolerance: ±5%; Power(Watts): 100mW; Voltage-Supply(Max): 75V; Temperature Coefficient: ±200ppm/℃; Operating Temperature: -55℃~+155℃
TP1-TP14 = Test-Point: Test Point 测试点
U8 U17 = STC32G12K128-35I-LQFP48: Supplier Part: C5210760; Manufacturer: STC; Supplier Footprint: LQFP-48(7x7); JLCPCB Part Class: 扩展库; Datasheet: https://atta.szlcsc.com/upload/public/pdf/source/20241226/E8981118341CB9C62D3D58EFD7554832.pdf; Supplier: LCSC
U9 = SE8650K2-HF: 输出类型:固定;工作电压:80V;输出电压:5V;输出电流:-;电源纹波抑制比(PSRR):-;输出极性:正极;; LCSC Part Name: 输入80V 输出5V; Supplier Part: C496616; Manufacturer: SEAWARD(思旺); Supplier Footprint: SOT-89-3; JLCPCB Part Class: 扩展库; Datasheet: https://atta.szlcsc.com/upload/public/pdf/source/20231204/E5912244F6D9E24D718D6BDA01187AC7.pdf; Supplier: LCSC; Output Type: 固定; Voltage - Supply: 80V; Output Voltage: 5V; standby current: 2uA; Features: 短路保护(SCP)；低ESR；热保护(TSD)；带使能; Output Configuration: 正极; Number of Outputs: 1
U10 U19 = FD6288Q: Supplier Part: C328453; Manufacturer: Fortior Tech(峰岹); Supplier Footprint: QFN-24-EP(4x4); JLCPCB Part Class: 扩展库; Datasheet: https://atta.szlcsc.com/upload/public/pdf/source/20241101/0E2856EB301EAFFED732065FB088D773.pdf; Supplier: LCSC

## Nets
+5V: C33.2 C34.2 C53.1 C54.1 C60.2 C61.2 L1.2 L2.2 LED6.2(A) LED7.2(A) TP10.1 TP14.1 U8.15(VCC/AVCC) U9.3(VOUT) U17.15(VCC/AVCC)
DVDD: C28.2 U4.8(DVDD) U6.14(VCC)
GND: C18.1 C19.1 C22.1 C23.1 C24.1 C27.1 C28.1 C29.1 C30.1 C31.2 C32.1 C33.1 C34.1 C35.1 C36.1 C37.1 C38.1 C39.1 C40.1 C46.2 C47.1 C48.1 C49.1 C50.1 C51.1 C52.1 C53.2 C54.2 C55.2 C59.1 C60.1 C61.1 C62.1 C63.1 C64.1 C65.1 C66.1 C77.2 CN7.3 CN7.4 CN8.3 CN8.4 CN9.1(-) CN9.3 CN9.4 CN11.3 CN11.4 CN13.2 CN13.5 D12.2(A) D19.2(A) LED4.1(K) LED5.1(-) Q5.1(S) Q5.2(S) Q5.3(S) Q6.1(S) Q6.2(S) Q6.3(S) Q9.1(S) Q9.2(S) Q9.3(S) Q10.1(S) Q10.2(S) Q10.3(S) Q15.1(S) Q15.2(S) Q15.3(S) Q16.1(S) Q16.2(S) Q16.3(S) Q17.1(S) Q17.2(S) Q17.3(S) Q21.1(S) Q21.2(S) Q21.3(S) Q22.1(S) Q22.2(S) Q22.3(S) Q23.1(S) Q23.2(S) Q23.3(S) R44.2 R45.1 R46.2 R47.1 R51.1 R59.1 R62.1 R65.1 R74.1 R78.1 R81.1 R84.1 SW2.0 TP9.1 TP13.1 U4.5(GND) U4.16(GND) U4.20(SN) U4.21(SP) U4.25(EP) U5.5(GND) U5.16(GND) U5.20(SN) U5.21(SP) U5.25(EP) U6.1(1OE#) U6.4(2OE#) U6.7(GND) U6.10(3OE#) U6.13(4OE#) U7.1(VSS) U8.17(GND/AGND/Vref-) U9.1(GND) U10.6(COM) U10.25(EP) U17.17(GND/AGND/Vref-) U19.6(COM) U19.25(EP)
VCCBAT: C29.2 C31.1 C40.2 C46.1 C47.2 C48.2 C49.2 C50.2 C51.2 CN9.2(+) D4.2(A) D5.2(A) D8.2(A) Q3.5(D) Q3.6(D) Q3.7(D) Q3.8(D) Q3.9(D) Q4.5(D) Q4.6(D) Q4.7(D) Q4.8(D) Q4.9(D) Q7.5(D) Q7.6(D) Q7.7(D) Q7.8(D) Q7.9(D) Q8.5(D) Q8.6(D) Q8.7(D) Q8.8(D) Q8.9(D) Q12.5(D) Q12.6(D) Q12.7(D) Q12.8(D) Q12.9(D) Q13.5(D) Q13.6(D) Q13.7(D) Q13.8(D) Q13.9(D) Q14.5(D) Q14.6(D) Q14.7(D) Q14.8(D) Q14.9(D) Q18.5(D) Q18.6(D) Q18.7(D) Q18.8(D) Q18.9(D) Q19.5(D) Q19.6(D) Q19.7(D) Q19.8(D) Q19.9(D) Q20.5(D) Q20.6(D) Q20.7(D) Q20.8(D) Q20.9(D) R50.2 R66.1 R73.2 R85.1 U7.3(VIN)
ABMF1: C37.2 R53.1 R56.1 R59.2 U8.28(CMP+/TXD_2/INT3/P3.7)
ABMF2: C64.2 R76.1 R77.1 R78.2 U17.28(CMP+/TXD_2/INT3/P3.7)
BATADC1: C36.2 R50.1 R51.2 U8.46(LINTX/CAN2_TX/PWM8_3/TXD4/ADC11/AD3/P0.3)
BATADC2: C63.2 R73.1 R74.2 U17.46(LINTX/CAN2_TX/PWM8_3/TXD4/ADC11/AD3/P0.3)
BBMF1: C38.2 R60.1 R61.1 R62.2 U8.25(CAN_TX_2/CMP+_3/TXD3_2/P5.1)
BBMF2: C65.2 R79.1 R80.1 R81.2 U17.25(CAN_TX_2/CMP+_3/TXD3_2/P5.1)
CBMF1: C39.2 R63.1 R64.1 R65.2 U8.24(P5.0/RXD3_2/CMP+_2/CAN_RX_2)
CBMF2: C66.2 R82.1 R83.1 R84.2 U17.24(P5.0/RXD3_2/CMP+_2/CAN_RX_2)
DBRX1: TP12.1 U8.19(P3.0/D-/RXD/INT4)
DBRX2: TP8.1 U17.19(P3.0/D-/RXD/INT4)
DBTX1: TP11.1 U8.20(P3.1/D+/TXD)
DBTX2: TP7.1 U17.20(P3.1/D+/TXD)
EN_1: U4.14(EN) U6.6(2Y)
EN_2: U5.14(EN) U6.8(3Y)
GPIO65: CN13.6 R46.1 U6.5(2A)
GPIO66: CN13.1 R45.2 U6.9(3A)
GPIO72: CN13.3 R47.2 U6.12(4A)
GPIO73: CN13.4 R44.1 U6.2(1A)
HOA1: R67.1 U10.19(HO1)
HOA2: R86.1 U19.19(HO1)
HOB1: R69.1 U10.16(HO2)
HOB2: R88.1 U19.16(HO2)
HOC1: R71.1 U10.13(HO3)
HOC2: R90.1 U19.13(HO3)
LED1: R52.1 U8.32(TXD_4/RD/P4.4)
LED2: R75.1 U17.32(TXD_4/RD/P4.4)
LOA1: R68.1 U10.11(LO1)
LOA2: R87.1 U19.11(LO1)
LOB1: R70.1 U10.10(LO2)
LOB2: R89.1 U19.10(LO2)
LOC1: R72.1 U10.9(LO3)
LOC2: R91.1 U19.9(LO3)
MID1: R56.2 R61.2 R64.2 U8.27(CMP-/RXD_2/INT2/P3.6)
MID2: R77.2 R80.2 R83.2 U17.27(CMP-/RXD_2/INT2/P3.6)
MOTOR1-A: CN8.1(-) Q3.1(S) Q3.2(S) Q3.3(S) Q5.5(D) Q5.6(D) Q5.7(D) Q5.8(D) Q5.9(D) U4.23(SH2)
MOTOR1-B: CN8.2(+) Q4.1(S) Q4.2(S) Q4.3(S) Q6.5(D) Q6.6(D) Q6.7(D) Q6.8(D) Q6.9(D) U4.18(SH1)
MOTOR2-A: CN7.1(-) Q7.1(S) Q7.2(S) Q7.3(S) Q9.5(D) Q9.6(D) Q9.7(D) Q9.8(D) Q9.9(D) U5.23(SH2)
MOTOR2-B: CN7.2(+) Q8.1(S) Q8.2(S) Q8.3(S) Q10.5(D) Q10.6(D) Q10.7(D) Q10.8(D) Q10.9(D) U5.18(SH1)
NSLEEP: R49.2 SW2.3 U4.13(nSLEEP) U5.13(nSLEEP)
PH_1: U4.15(PH) U6.3(1Y)
PH_2: U5.15(PH) U6.11(4Y)
PWMAH1: U8.33(PWM5/PWM1P_2/A8/P2.0) U10.22(HIN1)
PWMAH2: U17.33(PWM5/PWM1P_2/A8/P2.0) U19.22(HIN1)
PWMAL1: U8.34(PWM6/PWM1N_2/A9/P2.1) U10.1(LIN1)
PWMAL2: U17.34(PWM6/PWM1N_2/A9/P2.1) U19.1(LIN1)
PWMBH1: U8.35(PWM7/PWM2P_2/S2SS_2/S1SS_2/SS_2/A10/P2.2) U10.23(HIN2)
PWMBH2: U17.35(PWM7/PWM2P_2/S2SS_2/S1SS_2/SS_2/A10/P2.2) U19.23(HIN2)
PWMBL1: U8.36(PWM8/PWM2N_2/S2MOSI_2/S1MOSI_2/MOSI_2/A11/P2.3) U10.2(LIN2)
PWMBL2: U17.36(PWM8/PWM2N_2/S2MOSI_2/S1MOSI_2/MOSI_2/A11/P2.3) U19.2(LIN2)
PWMCH1: U8.37(PWM3P_2/SDA_2/S2MISO_2/S1MISO_2/MISO_2/A12/P2.4) U10.24(HIN3)
PWMCH2: U17.37(PWM3P_2/SDA_2/S2MISO_2/S1MISO_2/MISO_2/A12/P2.4) U19.24(HIN3)
PWMCL1: U8.38(PWM3N_2/SCL_2/S2SCLK_2/S1SCLK_2/SCLK_2/A13/P2.5) U10.3(LIN3)
PWMCL2: U17.38(PWM3N_2/SCL_2/S2SCLK_2/S1SCLK_2/SCLK_2/A13/P2.5) U19.3(LIN3)
PWMIN1: CN11.6 U8.43(CAN_RX/PWM5_3/RXD3/ADC8/AD0/P0.0) U8.44(CAN_TX/PWM6_3/TXD3/ADC9/AD1/P0.1)
PWMIN2: CN11.1 U17.43(CAN_RX/PWM5_3/RXD3/ADC8/AD0/P0.0) U17.44(CAN_TX/PWM6_3/TXD3/ADC9/AD1/P0.1)
VBA1: C56.1 D9.2(K) U10.20(VB1)
VBA2: C78.1 D16.2(K) U19.20(VB1)
VBB1: C57.1 D10.2(K) U10.17(VB2)
VBB2: C79.1 D17.2(K) U19.17(VB2)
VBC1: C58.1 D11.2(K) U10.14(VB3)
VBC2: C80.1 D18.2(K) U19.14(VB3)
VSA1: C56.2 Q14.1(S) Q14.2(S) Q14.3(S) Q15.5(D) Q15.6(D) Q15.7(D) Q15.8(D) Q15.9(D) R53.2 TP1.1 U10.18(VS1)
VSA2: C78.2 Q18.1(S) Q18.2(S) Q18.3(S) Q21.5(D) Q21.6(D) Q21.7(D) Q21.8(D) Q21.9(D) R76.2 TP4.1 U19.18(VS1)
VSB1: C57.2 Q13.1(S) Q13.2(S) Q13.3(S) Q16.5(D) Q16.6(D) Q16.7(D) Q16.8(D) Q16.9(D) R60.2 TP2.1 U10.15(VS2)
VSB2: C79.2 Q19.1(S) Q19.2(S) Q19.3(S) Q22.5(D) Q22.6(D) Q22.7(D) Q22.8(D) Q22.9(D) R79.2 TP5.1 U19.15(VS2)
VSC1: C58.2 Q12.1(S) Q12.2(S) Q12.3(S) Q17.5(D) Q17.6(D) Q17.7(D) Q17.8(D) Q17.9(D) R63.2 TP3.1 U10.12(VS3)
VSC2: C80.2 Q20.1(S) Q20.2(S) Q20.3(S) Q23.5(D) Q23.6(D) Q23.7(D) Q23.8(D) Q23.9(D) R82.2 TP6.1 U19.12(VS3)
$1N4655: C20.1 U4.2(VCP)
$1N4656: C18.2 C19.2 C20.2 D4.1(K) U4.1(VM)
$1N4660: C21.2 U4.3(CPH)
$1N4661: C21.1 U4.4(CPL)
$1N4662: C22.2 U4.6(VREF) U4.7(AVDD) U4.12(IDRIVE)
$1N4670: Q3.4(G) U4.24(GH2)
$1N4671: Q5.4(G) U4.22(GL2)
$1N4672: Q4.4(G) U4.17(GH1)
$1N4673: Q6.4(G) U4.19(GL1)
$1N4684: C25.1 U5.2(VCP)
$1N4685: C23.2 C24.2 C25.2 D5.1(K) U5.1(VM)
$1N4689: C26.2 U5.3(CPH)
$1N4690: C26.1 U5.4(CPL)
$1N4691: C27.2 U5.6(VREF) U5.7(AVDD) U5.12(IDRIVE)
$1N4697: Q7.4(G) U5.24(GH2)
$1N4698: Q9.4(G) U5.22(GL2)
$1N4699: Q8.4(G) U5.17(GH1)
$1N4700: Q10.4(G) U5.19(GL1)
$1N4740: C30.2 R48.2 SW2.2 U7.2(VOUT)
$1N4744: LED4.2(A) R48.1
$1N4745: LED5.2(+) R49.1
$2N1450: C35.2 L1.1 U8.16(Vref)
$2N1477: C32.2 U8.13(UCAP)
$2N2620: LED6.1(K) R52.2
$2N4916: C52.2 D8.1(K) U9.2(VIN)
$2N5818: C55.1 D9.1(A) D10.1(A) D11.1(A) D12.1(K) R66.2 U10.4(VCC)
$2N6770: Q14.4(G) R67.2
$2N6774: Q15.4(G) R68.2
$2N7452: Q13.4(G) R69.2
$2N7454: Q16.4(G) R70.2
$2N7674: Q12.4(G) R71.2
$2N7676: Q17.4(G) R72.2
$3N3040: C62.2 L2.1 U17.16(Vref)
$3N3052: C59.2 U17.13(UCAP)
$3N3141: LED7.1(K) R75.2
$3N3324: C77.1 D16.1(A) D17.1(A) D18.1(A) D19.1(K) R85.2 U19.4(VCC)
$3N3402: Q18.4(G) R86.2
$3N3404: Q21.4(G) R87.2
$3N3419: Q19.4(G) R88.2
$3N3421: Q22.4(G) R89.2
$3N3436: Q20.4(G) R90.2
$3N3438: Q23.4(G) R91.2

Not connected (* = marked no-connect by the designer): CN11 2* 5*; SW2 1*; U4 9(nFAULT)* 10(SNSOUT)* 11(SO)*; U5 8(DVDD)* 9(nFAULT)* 10(SNSOUT)* 11(SO)*; U8 1(P5.3/TXD4_2/CAN2_TX_2/LIN_TX_2)* 2(P0.5/AD5/ADC13/T3CLKO)* 3(P0.6/AD6/ADC14/T4/PWMFLT2_2)* 4(P0.7/AD7/T4CLKO)* 5(P1.0/ADC0/PWM1P/RXD2)* 6(P1.1/ADC1/PWM1N/TXD2)* 7(P4.7/TXD2_2/CAN2_TX_3/LIN_TX_3)* 8(P1.4/ADC4/PWM3P/MISO/S1MISO/S2MISO/SDA)* 9(P1.5/ADC5/PWM3N/SCLK/S1CLK/S2CLK/SCL)* 10(P1.6/ADC6/RXD_3/PWM4P/MCLKO_2/XTALO)* 11(P1.7/ADC7/TXD_3/PWM4N/PWM5_2/XTALI)* 12(P1.3/ADC3/MOSI/S2MOSI/S1MOSI/PWM2N/T2CLKO)* 14(P5.4/ADC2/PWM2P/PWM6_2/RST/MCLKO/SS_3/S1SS_3/S2SS_3/T2)* 18(P4.0/MOSI_3/S1MOSI_3/S2MOSI_3)* 21(P3.2/INT0/SCLK_4/SCL_4/PWMETI/PWMETI2)* 22(P3.3/INT1/MISO_4/SDA_4/PWM4N_4/PWM7_2)* 23(P3.4/T0/T1CLKO/MOSI_4/PWM4P_4/PWM8_2/CMPO)* 26(PWMFLT/SS_4/T0CLKO/T1/P3.5)* 29(PWMETI_3/CMPO_2/S2MISO_3/S1MISO_3/MISO_3/P4.1)* 30(CAN_RX_3/WR/P4.2)* 31(S2SCLK_3/S1SCLK_3/SCLK/RXD_4/P4.3)* 39(PWM4P_2/A14/P2.6)* 40(PWM4N_2/A15/P2.7)* 41(CAN_TX_3/ALE/P4.5)* 42(CAN_RX_3/CAN2_RX_3/RXD2_2/P4.6)* 45(LIN_RX/CAN2_RX/PWM7_3/RXD4/ADC10/AD2/P0.2)* 47(T3/ADC12/AD4/P0.4)* 48(LIN_RX_2/CAN2_RX_2/RXD4_2/P5.2)*; U10 5(NC)* 7(NC)* 8(NC)* 21(NC)*; U17 1(P5.3/TXD4_2/CAN2_TX_2/LIN_TX_2)* 2(P0.5/AD5/ADC13/T3CLKO)* 3(P0.6/AD6/ADC14/T4/PWMFLT2_2)* 4(P0.7/AD7/T4CLKO)* 5(P1.0/ADC0/PWM1P/RXD2)* 6(P1.1/ADC1/PWM1N/TXD2)* 7(P4.7/TXD2_2/CAN2_TX_3/LIN_TX_3)* 8(P1.4/ADC4/PWM3P/MISO/S1MISO/S2MISO/SDA)* 9(P1.5/ADC5/PWM3N/SCLK/S1CLK/S2CLK/SCL)* 10(P1.6/ADC6/RXD_3/PWM4P/MCLKO_2/XTALO)* 11(P1.7/ADC7/TXD_3/PWM4N/PWM5_2/XTALI)* 12(P1.3/ADC3/MOSI/S2MOSI/S1MOSI/PWM2N/T2CLKO)* 14(P5.4/ADC2/PWM2P/PWM6_2/RST/MCLKO/SS_3/S1SS_3/S2SS_3/T2)* 18(P4.0/MOSI_3/S1MOSI_3/S2MOSI_3)* 21(P3.2/INT0/SCLK_4/SCL_4/PWMETI/PWMETI2)* 22(P3.3/INT1/MISO_4/SDA_4/PWM4N_4/PWM7_2)* 23(P3.4/T0/T1CLKO/MOSI_4/PWM4P_4/PWM8_2/CMPO)* 26(PWMFLT/SS_4/T0CLKO/T1/P3.5)* 29(PWMETI_3/CMPO_2/S2MISO_3/S1MISO_3/MISO_3/P4.1)* 30(CAN_RX_3/WR/P4.2)* 31(S2SCLK_3/S1SCLK_3/SCLK/RXD_4/P4.3)* 39(PWM4P_2/A14/P2.6)* 40(PWM4N_2/A15/P2.7)* 41(CAN_TX_3/ALE/P4.5)* 42(CAN_RX_3/CAN2_RX_3/RXD2_2/P4.6)* 45(LIN_RX/CAN2_RX/PWM7_3/RXD4/ADC10/AD2/P0.2)* 47(T3/ADC12/AD4/P0.4)* 48(LIN_RX_2/CAN2_RX_2/RXD4_2/P5.2)*; U19 5(NC)* 7(NC)* 8(NC)* 21(NC)*

## Notes on the sheets
sheet 1
- 电机接口
- DIR1
- DIR2
- PWM1
- PWM2
- 左电机H桥
- 缓冲器
- 接口
- 稳压
- 右电机H桥
sheet 2
- 单片机
- 换向检测
- 电源电压监测
- 指示灯
- 电源输入
- 左
- 信号输入
- MOSFET
- 5V稳压
- MOS预驱
sheet 3
- 单片机
- 换向检测
- 电源电压监测
- 电调开关管
- 指示灯
- MOS预驱
